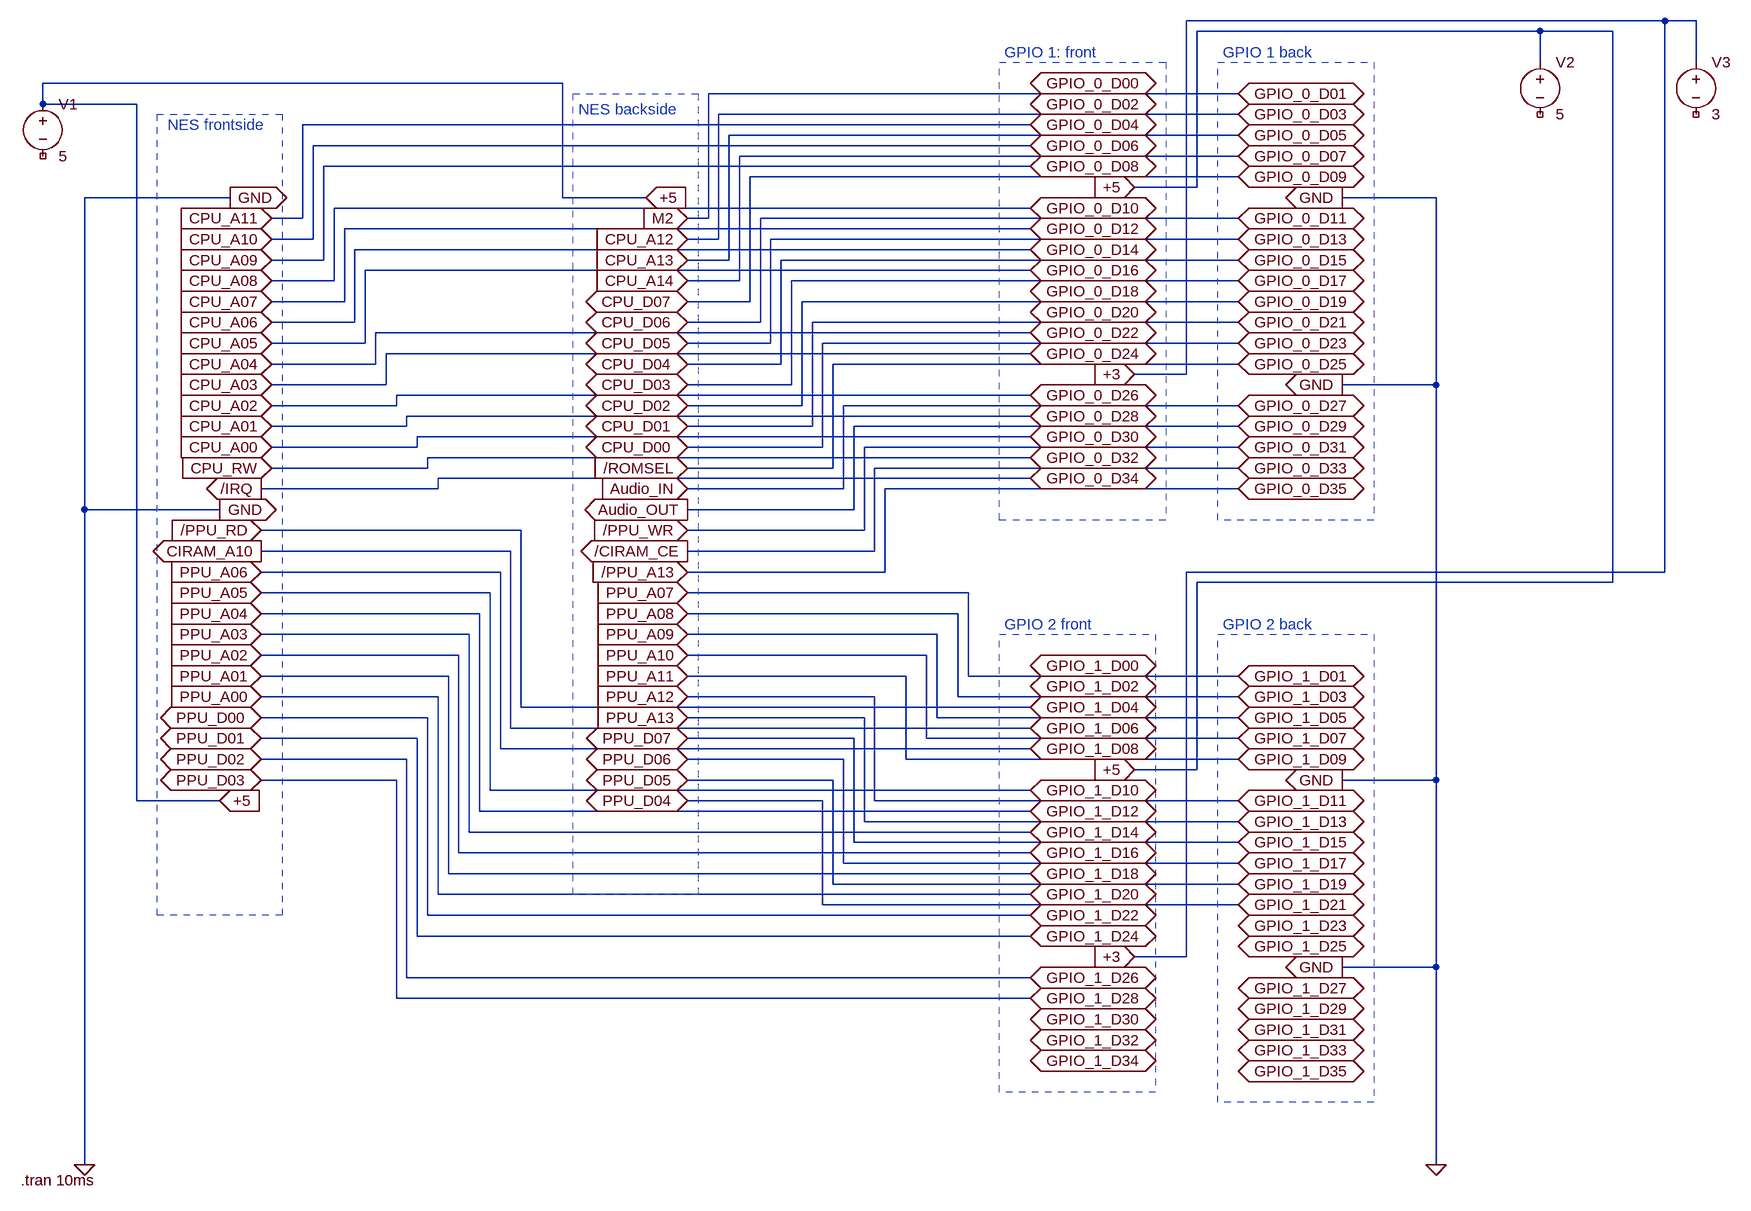
[diagram p0: schematic nes-cirtridge-if.asc]
nes-cirtridge-if.asc, the LTspice schematic file:
Version 4
SHEET 1 880 716
WIRE -288 -1360 -1024 -1360
WIRE -240 -1360 -288 -1360
WIRE -480 -1344 -1008 -1344
WIRE -368 -1344 -480 -1344
WIRE -480 -1296 -480 -1344
WIRE -240 -1296 -240 -1360
WIRE -1984 -1264 -2784 -1264
WIRE -944 -1248 -1760 -1248
WIRE -2784 -1232 -2784 -1264
WIRE -2640 -1232 -2784 -1232
WIRE -944 -1216 -1744 -1216
WIRE -1264 -1200 -2384 -1200
WIRE -944 -1184 -1728 -1184
WIRE -1264 -1168 -2368 -1168
WIRE -944 -1152 -1712 -1152
WIRE -1264 -1136 -2352 -1136
WIRE -944 -1120 -1696 -1120
WIRE -1008 -1104 -1008 -1344
WIRE -1008 -1104 -1104 -1104
WIRE -2496 -1088 -2720 -1088
WIRE -1984 -1088 -1984 -1264
WIRE -1856 -1088 -1984 -1088
WIRE -640 -1088 -784 -1088
WIRE -1264 -1072 -2336 -1072
WIRE -2384 -1056 -2384 -1200
WIRE -2384 -1056 -2432 -1056
WIRE -1760 -1056 -1760 -1248
WIRE -1760 -1056 -1792 -1056
WIRE -944 -1056 -1680 -1056
WIRE -1264 -1040 -2320 -1040
WIRE -2368 -1024 -2368 -1168
WIRE -2368 -1024 -2432 -1024
WIRE -1744 -1024 -1744 -1216
WIRE -1744 -1024 -1792 -1024
WIRE -944 -1024 -1664 -1024
WIRE -1264 -1008 -2304 -1008
WIRE -2352 -992 -2352 -1136
WIRE -2352 -992 -2432 -992
WIRE -1728 -992 -1728 -1184
WIRE -1728 -992 -1792 -992
WIRE -944 -992 -1648 -992
WIRE -1264 -976 -2288 -976
WIRE -2336 -960 -2336 -1072
WIRE -2336 -960 -2432 -960
WIRE -1712 -960 -1712 -1152
WIRE -1712 -960 -1792 -960
WIRE -944 -960 -1632 -960
WIRE -2320 -928 -2320 -1040
WIRE -2320 -928 -2432 -928
WIRE -1696 -928 -1696 -1120
WIRE -1696 -928 -1792 -928
WIRE -944 -928 -1616 -928
WIRE -2304 -896 -2304 -1008
WIRE -2304 -896 -2432 -896
WIRE -1680 -896 -1680 -1056
WIRE -1680 -896 -1792 -896
WIRE -944 -896 -1600 -896
WIRE -1264 -880 -2272 -880
WIRE -2288 -864 -2288 -976
WIRE -2288 -864 -2432 -864
WIRE -1664 -864 -1664 -1024
WIRE -1664 -864 -1792 -864
WIRE -944 -864 -1584 -864
WIRE -1264 -848 -2256 -848
WIRE -2272 -832 -2272 -880
WIRE -2272 -832 -2432 -832
WIRE -1648 -832 -1648 -992
WIRE -1648 -832 -1792 -832
WIRE -944 -832 -1568 -832
WIRE -1024 -816 -1024 -1360
WIRE -1024 -816 -1104 -816
WIRE -2256 -800 -2256 -848
WIRE -2256 -800 -2432 -800
WIRE -1632 -800 -1632 -960
WIRE -1632 -800 -1792 -800
WIRE -640 -800 -640 -1088
WIRE -640 -800 -784 -800
WIRE -1264 -784 -2240 -784
WIRE -2240 -768 -2240 -784
WIRE -2240 -768 -2432 -768
WIRE -1616 -768 -1616 -928
WIRE -1616 -768 -1792 -768
WIRE -944 -768 -1552 -768
WIRE -1264 -752 -2224 -752
WIRE -2224 -736 -2224 -752
WIRE -2224 -736 -2432 -736
WIRE -1600 -736 -1600 -896
WIRE -1600 -736 -1792 -736
WIRE -944 -736 -1536 -736
WIRE -1264 -720 -2208 -720
WIRE -2208 -704 -2208 -720
WIRE -2208 -704 -2432 -704
WIRE -1584 -704 -1584 -864
WIRE -1584 -704 -1792 -704
WIRE -944 -704 -1520 -704
WIRE -1264 -688 -2192 -688
WIRE -2192 -672 -2192 -688
WIRE -2192 -672 -2432 -672
WIRE -1568 -672 -1568 -832
WIRE -1568 -672 -1792 -672
WIRE -944 -672 -1504 -672
WIRE -1264 -656 -2176 -656
WIRE -2176 -640 -2176 -656
WIRE -2176 -640 -2448 -640
WIRE -1552 -640 -1552 -768
WIRE -1552 -640 -1792 -640
WIRE -944 -640 -1488 -640
WIRE -2720 -608 -2720 -1088
WIRE -2512 -608 -2720 -608
WIRE -1536 -608 -1536 -736
WIRE -1536 -608 -1792 -608
WIRE -2048 -576 -2448 -576
WIRE -1520 -576 -1520 -704
WIRE -1520 -576 -1792 -576
WIRE -2064 -544 -2448 -544
WIRE -1504 -544 -1504 -672
WIRE -1504 -544 -1792 -544
WIRE -2080 -512 -2448 -512
WIRE -1488 -512 -1488 -640
WIRE -1488 -512 -1792 -512
WIRE -288 -512 -288 -1360
WIRE -288 -512 -1024 -512
WIRE -368 -496 -368 -1344
WIRE -368 -496 -1008 -496
WIRE -2096 -480 -2448 -480
WIRE -1360 -480 -1792 -480
WIRE -2112 -448 -2448 -448
WIRE -1376 -448 -1792 -448
WIRE -2128 -416 -2448 -416
WIRE -1408 -416 -1792 -416
WIRE -2144 -384 -2448 -384
WIRE -1424 -384 -1792 -384
WIRE -2160 -352 -2448 -352
WIRE -1456 -352 -1792 -352
WIRE -1360 -352 -1360 -480
WIRE -944 -352 -1360 -352
WIRE -2176 -320 -2448 -320
WIRE -1504 -320 -1792 -320
WIRE -1376 -320 -1376 -448
WIRE -944 -320 -1376 -320
WIRE -2048 -304 -2048 -576
WIRE -1264 -304 -2048 -304
WIRE -2192 -288 -2448 -288
WIRE -1520 -288 -1792 -288
WIRE -1408 -288 -1408 -416
WIRE -944 -288 -1408 -288
WIRE -2064 -272 -2064 -544
WIRE -1264 -272 -2064 -272
WIRE -2208 -256 -2448 -256
WIRE -1536 -256 -1792 -256
WIRE -1424 -256 -1424 -384
WIRE -944 -256 -1424 -256
WIRE -2080 -240 -2080 -512
WIRE -1264 -240 -2080 -240
WIRE -2224 -224 -2448 -224
WIRE -1552 -224 -1792 -224
WIRE -1456 -224 -1456 -352
WIRE -944 -224 -1456 -224
WIRE -1008 -208 -1008 -496
WIRE -1008 -208 -1104 -208
WIRE -2240 -192 -2448 -192
WIRE -1568 -192 -1792 -192
WIRE -640 -192 -640 -800
WIRE -640 -192 -784 -192
WIRE -2096 -176 -2096 -480
WIRE -1264 -176 -2096 -176
WIRE -2640 -160 -2640 -1232
WIRE -2512 -160 -2640 -160
WIRE -1584 -160 -1792 -160
WIRE -1504 -160 -1504 -320
WIRE -944 -160 -1504 -160
WIRE -2112 -144 -2112 -448
WIRE -1264 -144 -2112 -144
WIRE -1520 -128 -1520 -288
WIRE -944 -128 -1520 -128
WIRE -2128 -112 -2128 -416
WIRE -1264 -112 -2128 -112
WIRE -1536 -96 -1536 -256
WIRE -944 -96 -1536 -96
WIRE -2144 -80 -2144 -384
WIRE -1264 -80 -2144 -80
WIRE -1552 -64 -1552 -224
WIRE -944 -64 -1552 -64
WIRE -2160 -48 -2160 -352
WIRE -1264 -48 -2160 -48
WIRE -1568 -32 -1568 -192
WIRE -944 -32 -1568 -32
WIRE -2176 -16 -2176 -320
WIRE -1264 -16 -2176 -16
WIRE -1584 0 -1584 -160
WIRE -944 0 -1584 0
WIRE -2192 16 -2192 -288
WIRE -1264 16 -2192 16
WIRE -2208 48 -2208 -256
WIRE -1264 48 -2208 48
WIRE -1024 80 -1024 -512
WIRE -1024 80 -1104 80
WIRE -640 96 -640 -192
WIRE -640 96 -784 96
WIRE -2224 112 -2224 -224
WIRE -1264 112 -2224 112
WIRE -2240 144 -2240 -192
WIRE -1264 144 -2240 144
WIRE -2720 400 -2720 -608
WIRE -640 400 -640 96
FLAG -2432 -1056 CPU_A11
IOPIN -2432 -1056 In
FLAG -2432 -1024 CPU_A10
IOPIN -2432 -1024 In
FLAG -2432 -992 CPU_A09
IOPIN -2432 -992 In
FLAG -2432 -960 CPU_A08
IOPIN -2432 -960 In
FLAG -2432 -928 CPU_A07
IOPIN -2432 -928 In
FLAG -2432 -896 CPU_A06
IOPIN -2432 -896 In
FLAG -2432 -864 CPU_A05
IOPIN -2432 -864 In
FLAG -2432 -832 CPU_A04
IOPIN -2432 -832 In
FLAG -2432 -800 CPU_A03
IOPIN -2432 -800 In
FLAG -2432 -768 CPU_A02
IOPIN -2432 -768 In
FLAG -2432 -736 CPU_A01
IOPIN -2432 -736 In
FLAG -2432 -704 CPU_A00
IOPIN -2432 -704 In
FLAG -2432 -672 CPU_RW
IOPIN -2432 -672 In
FLAG -2448 -640 /IRQ
IOPIN -2448 -640 Out
FLAG -2720 400 0
FLAG -2448 -544 CIRAM_A10
IOPIN -2448 -544 Out
FLAG -2448 -576 /PPU_RD
IOPIN -2448 -576 In
FLAG -2448 -512 PPU_A06
IOPIN -2448 -512 In
FLAG -2448 -480 PPU_A05
IOPIN -2448 -480 In
FLAG -2448 -448 PPU_A04
IOPIN -2448 -448 In
FLAG -2448 -416 PPU_A03
IOPIN -2448 -416 In
FLAG -2448 -384 PPU_A02
IOPIN -2448 -384 In
FLAG -2448 -352 PPU_A01
IOPIN -2448 -352 In
FLAG -2448 -320 PPU_A00
IOPIN -2448 -320 In
FLAG -2448 -288 PPU_D00
IOPIN -2448 -288 BiDir
FLAG -2448 -256 PPU_D01
IOPIN -2448 -256 BiDir
FLAG -2448 -224 PPU_D02
IOPIN -2448 -224 BiDir
FLAG -2448 -192 PPU_D03
IOPIN -2448 -192 BiDir
FLAG -1792 -928 CPU_D07
IOPIN -1792 -928 BiDir
FLAG -1792 -1024 CPU_A12
IOPIN -1792 -1024 In
FLAG -1792 -992 CPU_A13
IOPIN -1792 -992 In
FLAG -1792 -960 CPU_A14
IOPIN -1792 -960 In
FLAG -1792 -896 CPU_D06
IOPIN -1792 -896 BiDir
FLAG -1792 -864 CPU_D05
IOPIN -1792 -864 BiDir
FLAG -1792 -832 CPU_D04
IOPIN -1792 -832 BiDir
FLAG -1792 -800 CPU_D03
IOPIN -1792 -800 BiDir
FLAG -1792 -768 CPU_D02
IOPIN -1792 -768 BiDir
FLAG -1792 -736 CPU_D01
IOPIN -1792 -736 BiDir
FLAG -1792 -704 CPU_D00
IOPIN -1792 -704 BiDir
FLAG -1792 -672 /ROMSEL
IOPIN -1792 -672 In
FLAG -1792 -640 Audio_IN
IOPIN -1792 -640 In
FLAG -1792 -608 Audio_OUT
IOPIN -1792 -608 Out
FLAG -1792 -576 /PPU_WR
IOPIN -1792 -576 In
FLAG -1792 -544 /CIRAM_CE
IOPIN -1792 -544 Out
FLAG -1792 -512 /PPU_A13
IOPIN -1792 -512 In
FLAG -1792 -480 PPU_A07
IOPIN -1792 -480 In
FLAG -1792 -448 PPU_A08
IOPIN -1792 -448 In
FLAG -1792 -416 PPU_A09
IOPIN -1792 -416 In
FLAG -1792 -384 PPU_A10
IOPIN -1792 -384 In
FLAG -1792 -352 PPU_A11
IOPIN -1792 -352 In
FLAG -1792 -320 PPU_A12
IOPIN -1792 -320 In
FLAG -1792 -288 PPU_A13
IOPIN -1792 -288 In
FLAG -1792 -256 PPU_D07
IOPIN -1792 -256 BiDir
FLAG -1792 -224 PPU_D06
IOPIN -1792 -224 BiDir
FLAG -1792 -192 PPU_D05
IOPIN -1792 -192 BiDir
FLAG -1792 -160 PPU_D04
IOPIN -1792 -160 BiDir
FLAG -1264 -1264 GPIO_0_D00
IOPIN -1264 -1264 BiDir
FLAG -1264 -1232 GPIO_0_D02
IOPIN -1264 -1232 BiDir
FLAG -1264 -1200 GPIO_0_D04
IOPIN -1264 -1200 BiDir
FLAG -1264 -1168 GPIO_0_D06
IOPIN -1264 -1168 BiDir
FLAG -1264 -1136 GPIO_0_D08
IOPIN -1264 -1136 BiDir
FLAG -1264 -1072 GPIO_0_D10
IOPIN -1264 -1072 BiDir
FLAG -1264 -1040 GPIO_0_D12
IOPIN -1264 -1040 BiDir
FLAG -1264 -1008 GPIO_0_D14
IOPIN -1264 -1008 BiDir
FLAG -1264 -976 GPIO_0_D16
IOPIN -1264 -976 BiDir
FLAG -1264 -944 GPIO_0_D18
IOPIN -1264 -944 BiDir
FLAG -1264 -912 GPIO_0_D20
IOPIN -1264 -912 BiDir
FLAG -1264 -880 GPIO_0_D22
IOPIN -1264 -880 BiDir
FLAG -1264 -848 GPIO_0_D24
IOPIN -1264 -848 BiDir
FLAG -1264 -784 GPIO_0_D26
IOPIN -1264 -784 BiDir
FLAG -1264 -752 GPIO_0_D28
IOPIN -1264 -752 BiDir
FLAG -1264 -720 GPIO_0_D30
IOPIN -1264 -720 BiDir
FLAG -1264 -688 GPIO_0_D32
IOPIN -1264 -688 BiDir
FLAG -1264 -656 GPIO_0_D34
IOPIN -1264 -656 BiDir
FLAG -944 -1248 GPIO_0_D01
IOPIN -944 -1248 BiDir
FLAG -944 -1216 GPIO_0_D03
IOPIN -944 -1216 BiDir
FLAG -944 -1184 GPIO_0_D05
IOPIN -944 -1184 BiDir
FLAG -944 -1152 GPIO_0_D07
IOPIN -944 -1152 BiDir
FLAG -944 -1120 GPIO_0_D09
IOPIN -944 -1120 BiDir
FLAG -944 -1056 GPIO_0_D11
IOPIN -944 -1056 BiDir
FLAG -944 -1024 GPIO_0_D13
IOPIN -944 -1024 BiDir
FLAG -944 -992 GPIO_0_D15
IOPIN -944 -992 BiDir
FLAG -944 -960 GPIO_0_D17
IOPIN -944 -960 BiDir
FLAG -944 -928 GPIO_0_D19
IOPIN -944 -928 BiDir
FLAG -944 -896 GPIO_0_D21
IOPIN -944 -896 BiDir
FLAG -944 -864 GPIO_0_D23
IOPIN -944 -864 BiDir
FLAG -944 -832 GPIO_0_D25
IOPIN -944 -832 BiDir
FLAG -944 -768 GPIO_0_D27
IOPIN -944 -768 BiDir
FLAG -944 -736 GPIO_0_D29
IOPIN -944 -736 BiDir
FLAG -944 -704 GPIO_0_D31
IOPIN -944 -704 BiDir
FLAG -944 -672 GPIO_0_D33
IOPIN -944 -672 BiDir
FLAG -944 -640 GPIO_0_D35
IOPIN -944 -640 BiDir
FLAG -1264 -368 GPIO_1_D00
IOPIN -1264 -368 BiDir
FLAG -1264 -336 GPIO_1_D02
IOPIN -1264 -336 BiDir
FLAG -1264 -304 GPIO_1_D04
IOPIN -1264 -304 BiDir
FLAG -1264 -272 GPIO_1_D06
IOPIN -1264 -272 BiDir
FLAG -1264 -240 GPIO_1_D08
IOPIN -1264 -240 BiDir
FLAG -1264 -176 GPIO_1_D10
IOPIN -1264 -176 BiDir
FLAG -1264 -144 GPIO_1_D12
IOPIN -1264 -144 BiDir
FLAG -1264 -112 GPIO_1_D14
IOPIN -1264 -112 BiDir
FLAG -1264 -80 GPIO_1_D16
IOPIN -1264 -80 BiDir
FLAG -1264 -48 GPIO_1_D18
IOPIN -1264 -48 BiDir
FLAG -1264 -16 GPIO_1_D20
IOPIN -1264 -16 BiDir
FLAG -1264 16 GPIO_1_D22
IOPIN -1264 16 BiDir
FLAG -1264 48 GPIO_1_D24
IOPIN -1264 48 BiDir
FLAG -1264 112 GPIO_1_D26
IOPIN -1264 112 BiDir
FLAG -1264 144 GPIO_1_D28
IOPIN -1264 144 BiDir
FLAG -1264 176 GPIO_1_D30
IOPIN -1264 176 BiDir
FLAG -1264 208 GPIO_1_D32
IOPIN -1264 208 BiDir
FLAG -1264 240 GPIO_1_D34
IOPIN -1264 240 BiDir
FLAG -944 -352 GPIO_1_D01
IOPIN -944 -352 BiDir
FLAG -944 -320 GPIO_1_D03
IOPIN -944 -320 BiDir
FLAG -944 -288 GPIO_1_D05
IOPIN -944 -288 BiDir
FLAG -944 -256 GPIO_1_D07
IOPIN -944 -256 BiDir
FLAG -944 -224 GPIO_1_D09
IOPIN -944 -224 BiDir
FLAG -944 -160 GPIO_1_D11
IOPIN -944 -160 BiDir
FLAG -944 -128 GPIO_1_D13
IOPIN -944 -128 BiDir
FLAG -944 -96 GPIO_1_D15
IOPIN -944 -96 BiDir
FLAG -944 -64 GPIO_1_D17
IOPIN -944 -64 BiDir
FLAG -944 -32 GPIO_1_D19
IOPIN -944 -32 BiDir
FLAG -944 0 GPIO_1_D21
IOPIN -944 0 BiDir
FLAG -944 32 GPIO_1_D23
IOPIN -944 32 BiDir
FLAG -944 64 GPIO_1_D25
IOPIN -944 64 BiDir
FLAG -944 128 GPIO_1_D27
IOPIN -944 128 BiDir
FLAG -944 160 GPIO_1_D29
IOPIN -944 160 BiDir
FLAG -944 192 GPIO_1_D31
IOPIN -944 192 BiDir
FLAG -944 224 GPIO_1_D33
IOPIN -944 224 BiDir
FLAG -944 256 GPIO_1_D35
IOPIN -944 256 BiDir
FLAG -2512 -608 GND
IOPIN -2512 -608 Out
FLAG -2496 -1088 GND
IOPIN -2496 -1088 Out
FLAG -2512 -160 +5
IOPIN -2512 -160 In
FLAG -1856 -1088 +5
IOPIN -1856 -1088 In
FLAG -1792 -1056 M2
IOPIN -1792 -1056 In
FLAG -784 -1088 GND
IOPIN -784 -1088 Out
FLAG -784 -800 GND
IOPIN -784 -800 Out
FLAG -784 -192 GND
IOPIN -784 -192 Out
FLAG -784 96 GND
IOPIN -784 96 Out
FLAG -640 400 0
FLAG -1104 -1104 +5
IOPIN -1104 -1104 In
FLAG -1104 -816 +3
IOPIN -1104 -816 In
FLAG -1104 -208 +5
IOPIN -1104 -208 In
FLAG -1104 80 +3
IOPIN -1104 80 In
SYMBOL voltage -2784 -1248 R0
WINDOW 123 0 0 Left 2
WINDOW 39 0 0 Left 2
SYMATTR InstName V1
SYMATTR Value 5
SYMBOL voltage -480 -1312 R0
WINDOW 123 0 0 Left 2
WINDOW 39 0 0 Left 2
SYMATTR InstName V2
SYMATTR Value 5
SYMBOL voltage -240 -1312 R0
WINDOW 123 0 0 Left 2
WINDOW 39 0 0 Left 2
SYMATTR InstName V3
SYMATTR Value 3
TEXT -2592 -1200 Left 2 ;NES frontside
TEXT -1960 -1224 Left 2 ;NES backside
TEXT -1304 -1312 Left 2 ;GPIO 1: front
TEXT -968 -1312 Left 2 ;GPIO 1 back
TEXT -1304 -432 Left 2 ;GPIO 2 front
TEXT -968 -432 Left 2 ;GPIO 2 back
TEXT -2818 424 Left 2 !.tran 10ms
RECTANGLE Normal -1056 -592 -1312 -1296 2
RECTANGLE Normal -736 -592 -976 -1296 2
RECTANGLE Normal -1072 288 -1312 -416 2
RECTANGLE Normal -736 304 -976 -416 2
RECTANGLE Normal -1776 -16 -1968 -1248 2
RECTANGLE Normal -2416 16 -2608 -1216 2

The netlist it stands for:
* nes-cirtridge-if.asc
V1 +5 NC_01 5
V2 +5 NC_02 5
V3 +3 NC_03 3
* NES frontside
* NES backside
* GPIO 1: front
* GPIO 1 back
* GPIO 2 front
* GPIO 2 back
.tran 10ms
.backanno
.end